# EAGLE design T-11_Version_7 (EAGLE 7.1.0)
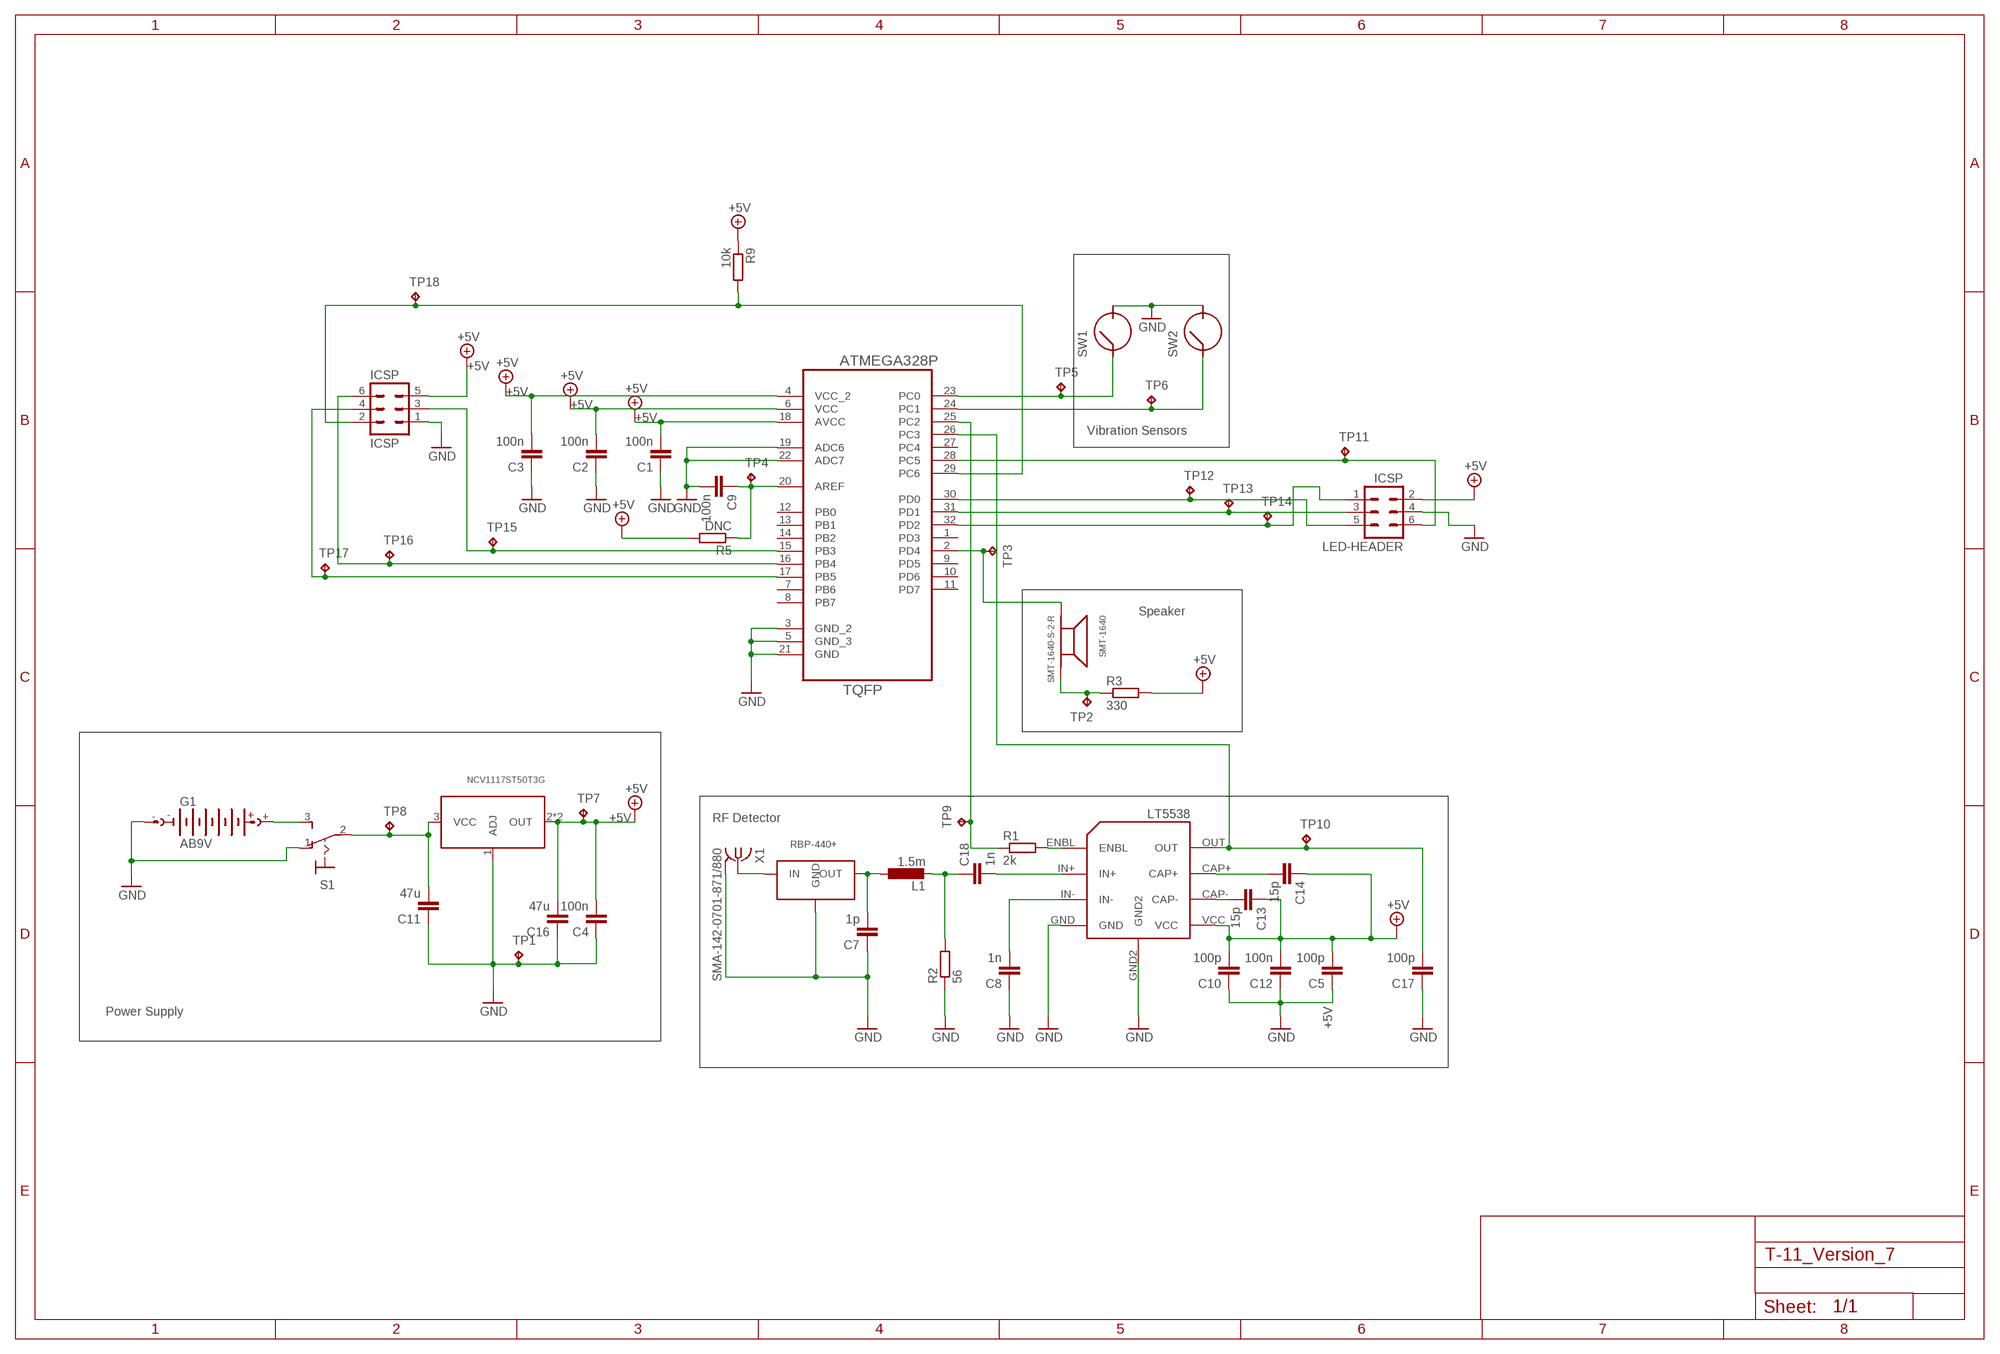
[diagram p0: schematic, sheet 1]

## Parts
C1  100n  C-EUC0805  [C0805]
C2  100n  C-EUC0805  [C0805]
C3  100n  C-EUC0805  [C0805]
C4  100n  C-EUC0805  [C0805]
C5  100p  C-EUC0805  [C0805]
C7  1p  C-EUC0805  [C0805]
C8  1n  C-EUC0805  [C0805]
C9  100n  C-EUC0805  [C0805]
C10  100p  C-EUC0805  [C0805]
C11  47u  C-EUC0805  [C0805]
C12  100n  C-EUC0805  [C0805]
C13  15p  C-EUC0805  [C0805]
C14  15p  C-EUC0805  [C0805]
C16  47u  C-EUC0805  [C0805]
C17  100p  C-EUC0805  [C0805]
C18  1n  C-EUC0805  [C0805]
G1  AB9V  [AB9V]
ICSP  ICSP  MA03-2  [MA03-2]
L1  1.5m  L-EUL2825P  [L2825P]
LED-HEADER  ICSP  MA03-2  [MA03-2]
LT5538  LT5538  [LT5538]
NVC1  NCV1117ST50T3G  [SOT223]
R1  2k  R-EU_R0805  [R0805]
R2  56  R-EU_R0805  [R0805]
R3  330  R-EU_R0805  [R0805]
R5  DNC  R-EU_R0805  [R0805]
R9  10k  R-EU_R0805  [R0805]
RBP-440+  RBP-440+  [GP731]
S1  320-916  [320-916]
SMT-1640  SMT-1640-S-2-R  [SMT-1640]
SW1  SW-1801X  [SW-1801X]
SW2  SW-1801X  [SW-1801X]
TP1  TPTP10R  [TP10R]
TP2  TPTP10R  [TP10R]
TP3  TPTP10R  [TP10R]
TP4  TPTP10R  [TP10R]
TP5  TPTP10R  [TP10R]
TP6  TPTP10R  [TP10R]
TP7  TPTP10R  [TP10R]
TP8  TPTP10R  [TP10R]
TP9  TPTP10R  [TP10R]
TP10  TPTP10R  [TP10R]
TP11  TPTP10R  [TP10R]
TP12  TPTP10R  [TP10R]
TP13  TPTP10R  [TP10R]
TP14  TPTP10R  [TP10R]
TP15  TPTP10R  [TP10R]
TP16  TPTP10R  [TP10R]
TP17  TPTP10R  [TP10R]
TP18  TPTP10R  [TP10R]
U1  ATMEGA328P-AU  [QFP80P900X900X120-32N]
X1  SMA-142-0701-871/880  [SMA-142-0701-871]

## Nets
+5V: C1.2 C2.2 C3.2 C4.2 C5.2 C10.2 C12.2 C13.1 C14.1 C16.2 ICSP.5 LED-HEADER.2 LT5538.VCC NVC1.2(OUT) NVC1.4(OUT) R3.2 R5.2 R9.1 TP7.TP U1.4(VCC_2) U1.6(VCC) U1.18(AVCC)
ANT_IN_1: C7.2 L1.1 RBP-440+.6(OUT)
ANT_IN_2: C18.1 L1.2 R2.2
GND: C1.1 C2.1 C3.1 C4.1 C5.1 C7.1 C8.1 C9.2 C10.1 C11.1 C12.1 C16.1 C17.1 G1.- ICSP.1 LED-HEADER.4 LT5538.GND LT5538.GND2 NVC1.1(ADJ) R2.1 RBP-440+.1(GND) RBP-440+.3(GND) RBP-440+.4(GND) RBP-440+.5(GND) RBP-440+.7(GND) RBP-440+.8(GND) S1.1(O) SW1.P$2 SW2.P$2 TP1.TP U1.3(GND_2) U1.5(GND_3) U1.19(ADC6) U1.21(GND) U1.22(ADC7) X1.2@1 X1.2@2 X1.2@3 X1.2@4
INDICATOR_1: LED-HEADER.1 TP14.TP U1.32(PD2)
INDICATOR_2: LED-HEADER.3 TP13.TP U1.31(PD1)
INDICATOR_3: LED-HEADER.5 TP12.TP U1.30(PD0)
MISO: ICSP.6 TP16.TP U1.16(PB4)
MOSI: ICSP.3 TP15.TP U1.15(PB3)
N$1: LED-HEADER.6 TP11.TP U1.28(PC5)
N$2: RBP-440+.2(IN) X1.1
N$3: R3.1 SMT-1640.P$1(OUT) TP2.TP
N$4: G1.+ S1.3(S)
N$5: C18.2 LT5538.IN+
N$6: LT5538.ENBL R1.2
N$8: C14.2 LT5538.CAP+
N$9: C13.2 LT5538.CAP-
N$10: C9.1 R5.1 TP4.TP U1.20(AREF)
N$12: SMT-1640.P$2(IN) TP3.TP U1.2(PD4)
PS_VIN: C11.2 NVC1.3(VCC) S1.2(P) TP8.TP
RESET: ICSP.2 R9.2 TP18.TP U1.29(PC6)
RF_ENABLE: R1.1 TP9.TP U1.25(PC2)
RF_IN-: C8.2 LT5538.IN-
RF_OUT: C17.2 LT5538.OUT TP10.TP U1.26(PC3)
SCK: ICSP.4 TP17.TP U1.17(PB5)
VIB_1: SW2.P$1 TP6.TP U1.24(PC1)
VIB_2: SW1.P$1 TP5.TP U1.23(PC0)
Unconnected: U1.1(PD3) U1.7(PB6) U1.8(PB7) U1.9(PD5) U1.10(PD6) U1.11(PD7) U1.12(PB0) U1.13(PB1) U1.14(PB2) U1.27(PC4)

## Notes on the sheet
- Vibration Sensors
- Speaker
- RF Detector
- Power Supply

## Library data of the parts
C1-C5 C7-C14 C16-C18 = rcl:C-EU: CAPACITOR, European symbol
G1 = battery:AB9V: 9-V BATTERY CLIP
ICSP LED-HEADER = con-lstb:MA03-2: PIN HEADER; OC_FARNELL: unknown; OC_NEWARK: unknown
L1 = resistor:L-EU: INDUCTOR, European symbol
LT5538 = LT5538:LT5538
NVC1 = sym:NCV1117ST50T3G
R1-R3 R5 R9 = resistor:R-EU_: RESISTOR, European symbol; SPICEPREFIX: R
RBP-440+ = RBP:RBP-440+: Band Pass Filter 410 - 470 MHZ
S1 = switch:320-916: TOGGLE SWITCH distributor RS Components
SMT-1640 = SMT:SMT-1640-S-2-R: pizo buzzer
SW1 SW2 = SW18xxx:SW-1801X: Vibration Sensor
TP1-TP18 = testpad:TP: Test pad
U1 = Ava:ATMEGA328P-AU; DESCRIPTION: 8-bit Microcontroller with In-System Programmable Flash; MPN: ATMEGA328P-AU; OC_FARNELL: 1715486; OC_NEWARK: 14R4631; PACKAGE: TQFP-32; SUPPLIER: Atmel
X1 = con-coax:SMA-: SMA 50 Ohm End Launch Jack Receptacle - Round Contact Johnson Components Source: www.johnsoncomponents.com .. J502-ND.pdf; MF: JOHNSON COMPONENTS; MPN: 142-0701-871; OC_FARNELL: 1339835; OC_NEWARK: 91B6105

## Board
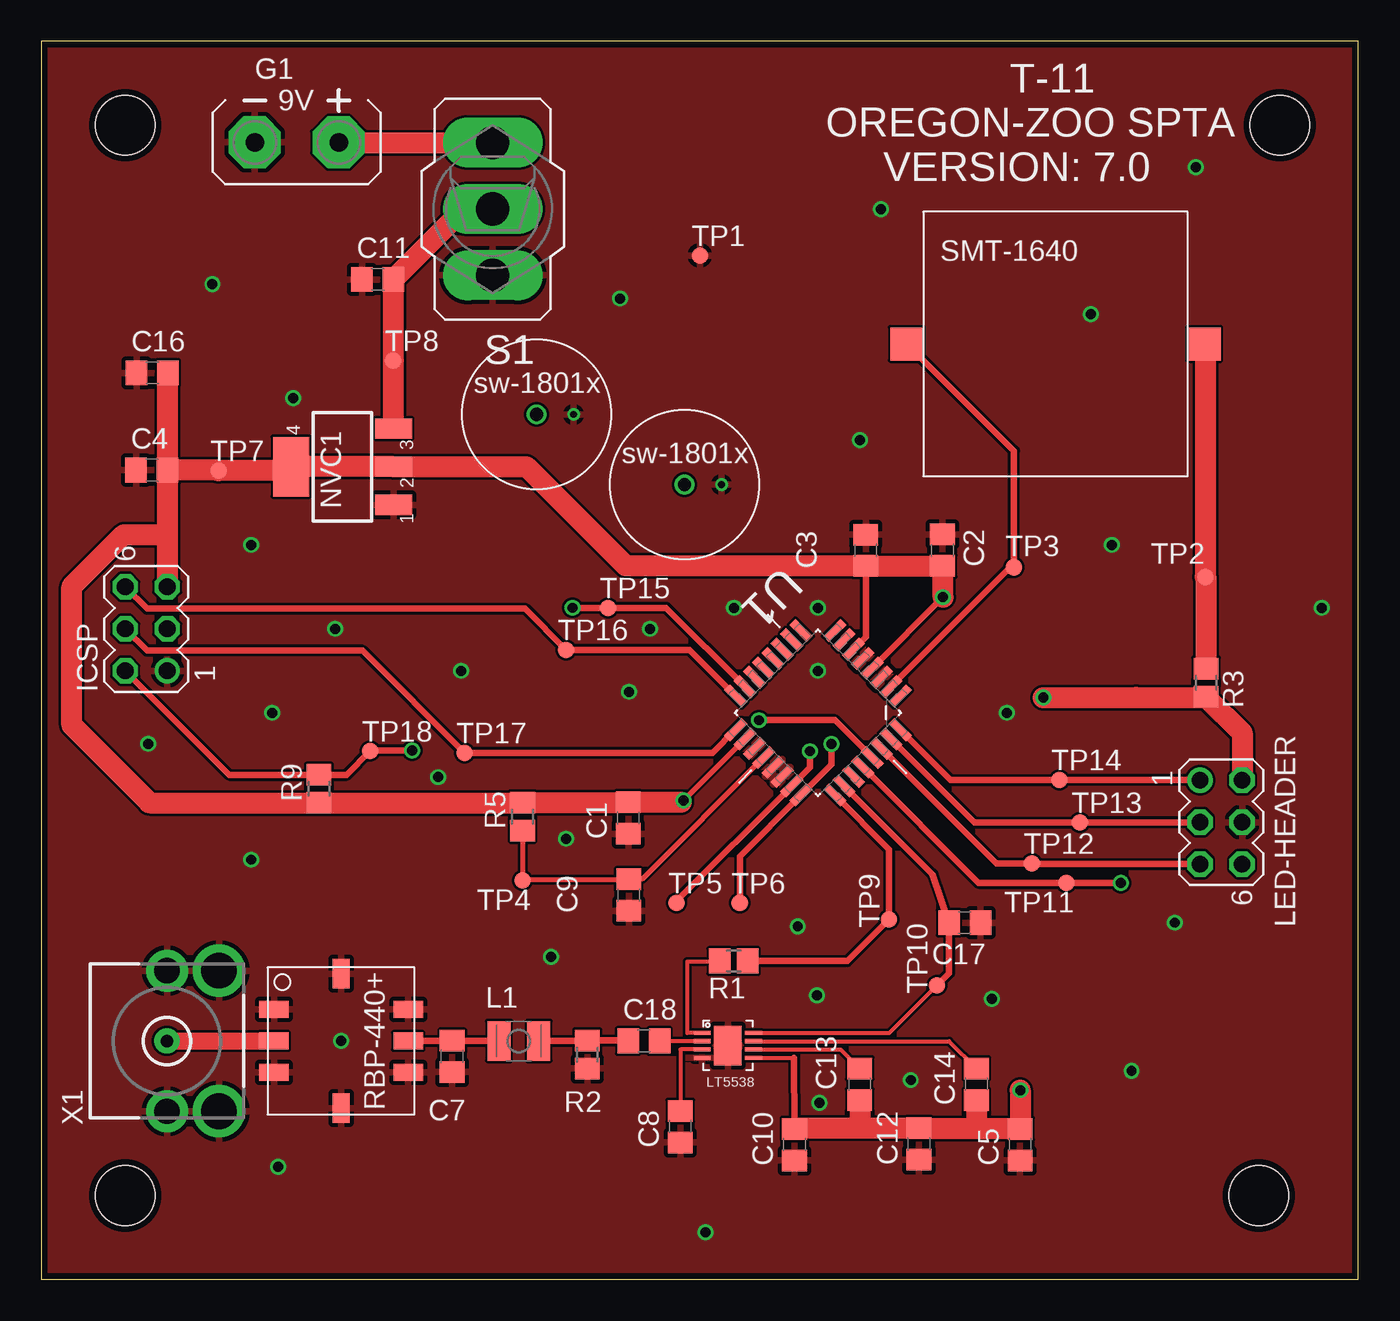
[diagram p1: board, top side]
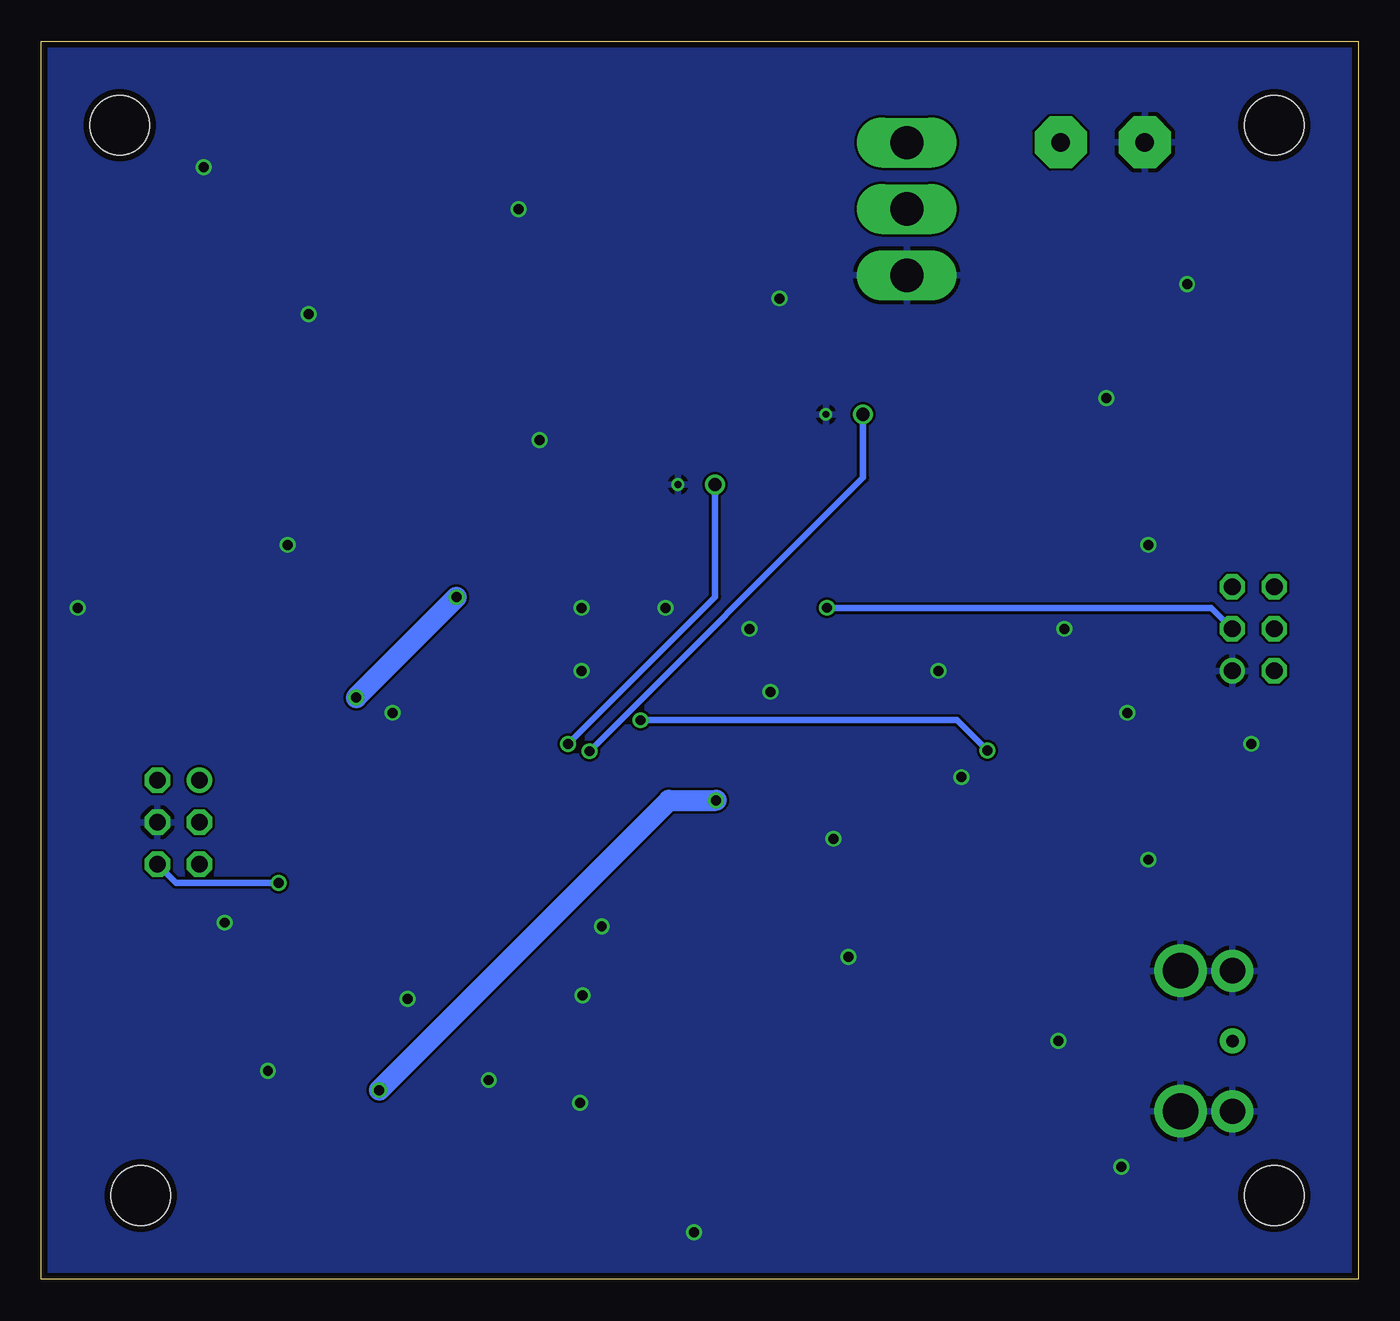
[diagram p2: board, bottom side, seen from below]

Size 79.68 x 74.92 mm. Coordinates in mm from the lower left corner, seen from the top.
Outline: 0,0 79.68,0 79.68,74.92 0,74.92 0,0
Copper layers (1*16): Top 0.0356mm / dielectric 1.5011mm / Bottom 0.0356mm
Design rules "OHS-Park": minimum track width 6mil, minimum drill 13mil, track to track 6mil, track to pad 6mil, pad to pad 6mil, via to via 6mil, smd to smd 6mil, copper to edge 15mil, drill to drill 6mil, minimum pad ring 7mil, minimum via ring 7mil, stop-mask expansion 3mil, vias tented up to drill 0mil, thermal gap 10mil
Holes 3.6 mm at 5.08,69.85 73.66,5.08 5.08,5.08 74.93,69.85

### Footprints (pad centres in the part's own frame; a part is rotated, then mirrored left to right if it is on the bottom)
C0805 = smd 1.3 x 1.5: 1 -0.95,0; 2 0.95,0
AB9V = drill 1.118 pad 3.15 octagon: + 0,2.54; - 0,-2.54
MA03-2 = drill 1.016: 1 -2.54,-1.27 | drill 1.016 octagon: 2 -2.54,1.27; 3 0,-1.27; 4 0,1.27; 5 2.54,-1.27; 6 2.54,1.27
L2825P = smd 1.4 x 2.4: 1 -1.2,0; 2 1.2,0
LT5538 = smd 0.25 x 1: CAP+ -0.22,1.58; CAP- 0.28,1.58; ENBL -0.72,-1.52; GND 0.78,-1.52; IN+ -0.22,-1.52; IN- 0.28,-1.52; OUT -0.72,1.58; VCC 0.78,1.58 | smd 2.38 x 1.65: GND2 0.05,0.025
SOT223 = smd 1.219 x 2.235: 1 -2.311,-3.099; 2 0,-3.099; 3 2.311,-3.099 | smd 3.6 x 2.2: 4 0,3.099
R0805 = smd 1.3 x 1.5: 1 -0.85,0; 2 0.85,0
GP731 = smd 1.016 x 1.778: 1 -1.905,-4.064; 2 0,-4.064; 3 1.905,-4.064; 5 1.905,4.064; 6 0,4.064; 7 -1.905,4.064 | smd 1.778 x 1.016: 4 4.064,0; 8 -4.064,0
320-916 = drill 2.007 long: 1 0,4.013; 2 0,0; 3 0,-4.013
SMT-1640 = smd 2 x 2: P$1 9,0; P$2 -9,0
SW-1801X = drill 0.8: P$1 0,0 | drill 0.406: P$2 2.25,0
TP10R = smd 1 x 1: TP 0,0
QFP80P900X900X120-32N = smd 1.473 x 0.508: 1 -4.242,2.794; 2 -4.242,2.007; 3 -4.242,1.194; 4 -4.242,0.406; 5 -4.242,-0.406; 6 -4.242,-1.194; 7 -4.242,-2.007; 8 -4.242,-2.794; 17 4.242,-2.794; 18 4.242,-2.007; 19 4.242,-1.194; 20 4.242,-0.406; 21 4.242,0.406; 22 4.242,1.194; 23 4.242,2.007; 24 4.242,2.794 | smd 0.508 x 1.473: 9 -2.794,-4.242; 10 -2.007,-4.242; 11 -1.194,-4.242; 12 -0.406,-4.242; 13 0.406,-4.242; 14 1.194,-4.242; 15 2.007,-4.242; 16 2.794,-4.242; 25 2.794,4.242; 26 2.007,4.242; 27 1.194,4.242; 28 0.406,4.242; 29 -0.406,4.242; 30 -1.194,4.242; 31 -2.007,4.242; 32 -2.794,4.242
SMA-142-0701-871 = drill 0.762 pad 1.524: 1 0,0 | drill 1.524 pad 2.54: 2@1 -4.255,0; 2@2 4.255,0 | drill 2.159 pad 2.794: 2@3 -4.255,-3.15; 2@4 4.255,-3.15

### Placement (x,y rotation side)
C1  35.52,27.92 90 top
C2  54.53,44.13 270 top
C3  49.89,44.12 270 top
C4  6.69,48.97 0 top
C5  59.22,8.16 90 top
C7  24.86,13.5 90 top
C8  38.66,9.25 90 top
C9  35.55,23.26 270 top
C10  45.57,8.15 90 top
C11  20.35,60.51 0 top
C12  53.11,8.2 90 top
C13  49.52,11.82 90 top
C14  56.57,11.82 90 top
C16  6.71,54.86 0 top
C17  55.88,21.59 180 top
C18  36.46,14.43 0 top
G1  15.45,68.81 270 top
ICSP  6.35,39.37 90 top
L1  28.89,14.43 0 top
LED-HEADER  71.39,27.67 270 top
LT5538  41.51,14.2 270 top
NVC1  18.22,49.18 90 top
R1  41.89,19.27 180 top
R2  33.04,13.62 90 top
R3  70.48,36.11 270 top
R5  29.12,28.01 90 top
R9  16.8,29.69 90 top
RBP-440+  18.14,14.43 270 top
S1  27.31,64.77 180 top
SMT-1640  61.37,56.61 0 top
SW1  29.96,52.35 0 top
SW2  38.91,48.1 0 top
TP1  39.85,61.95 0 top
TP2  70.43,42.51 180 top
TP3  58.85,43.09 0 top
TP4  29.13,24.15 180 top
TP5  38.44,22.79 0 top
TP6  42.26,22.78 0 top
TP7  10.73,48.94 0 top
TP8  21.29,55.6 0 top
TP9  51.3,21.79 90 top
TP10  54.2,17.8 90 top
TP11  62.03,24.01 180 top
TP12  59.94,25.18 0 top
TP13  62.84,27.65 0 top
TP14  61.61,30.24 0 top
TP15  34.29,40.64 0 top
TP16  31.75,38.1 0 top
TP17  25.62,31.87 0 top
TP18  19.9,31.97 0 top
U1  46.99,34.29 225 top
X1  7.61,14.43 90 top

### Tracks (layer width: path | path; a pad name or v marks a point on that pad's centre or on a via)
+5V  (via drill 0.6)
  Top 0.254: LT5538.VCC 45.55,13.42
  Top 0.305: U1.18 v38.85,28.99
  Top 0.406: 6.32,29.08 6.31,29.07 6.53,28.86 6.55,28.84 | U1.6 49.88,38.87 C3.2 49.87,43.19 | U1.4 v54.56,41.28 54.45,41.39 | 54.56,43.2 C2.2 | NVC1.4 14.75,48.94 | TP7.TP 10.7,48.97 | C4.2 7.62,48.93 | 66.21,35.21 66.23,35.23 | 45.55,13.42 C10.2 45.55,9.15 | C13.1 49.55,10.87 | 70.48,35.23 R3.2 | R5.2 | v38.85,28.99 38.73,28.87
  Top 1.27: v54.56,41.28 54.56,43.2 C2.2 C3.2 | 14.75,48.94 TP7.TP | 10.7,48.97 C4.2 | C4.2 C16.2 | v60.63,35.21 66.21,35.21 | 7.62,48.93 7.62,45.07 | 7.62,45.07 ICSP.5 | NVC1.4 NVC1.2 29.36,49.18 35.35,43.19 49.87,43.19 | 49.55,9.15 C12.2 56.53,9.15 | 49.55,9.15 45.55,9.15 | 49.55,10.87 49.55,9.15 | 66.23,35.23 70.48,35.23 | R3.2 72.66,33.08 LED-HEADER.2 | R5.2 C1.2 38.73,28.87 | 56.53,9.15 59.04,9.15 C5.2 59.24,9.13 v59.24,11.46 | C14.1 56.57,9.19 56.53,9.15 | 6.55,28.84 R9.1 29.09,28.84 R5.2 | 6.53,28.86 1.85,33.54 1.85,41.92 5,45.07 7.62,45.07
  Bottom 1.27: v54.56,41.28 v60.63,35.21 | v59.24,11.46 41.7,28.99 v38.85,28.99
ANT_IN_1
  Top 0.254: RBP-440+.6 21.99,14.43
  Top 0.406: RBP-440+.6 24.86,14.43 C7.2 28.16,14.45 28.16,14.16 27.7,14.16 L1.1
ANT_IN_2
  Top 0.406: L1.2 33.03,14.43 R2.2 35.51,14.47 C18.1
GND  (via drill 0.6)
  other vias: 10.35,60.22 31.75,26.67 50.8,64.77 69.85,67.31 64.77,44.45 63.5,58.42 77.47,40.64 35.01,59.36 24,30.4 15.24,53.34 13.97,34.29 17.78,39.37 25.4,36.83 35.56,35.56 36.83,39.37 41.91,40.64 46.99,40.64 58.42,34.29 68.58,21.59 57.51,16.97 65.97,12.62 30.84,19.51 12.7,25.4 40.19,2.85 18.14,14.43 14.33,6.81 47.09,10.68 46.92,17.19 45.77,21.37 52.61,12.07 49.53,50.8 12.7,44.45 46.99,36.83 6.46,32.42
  pour Top (isolate 0.01): 0,74.93 80.01,74.93 80.01,0 0,0
  pour Bottom (isolate 0.01): 0,74.93 80.01,74.93 80.01,0 0,0
INDICATOR_1
  Top 0.406: U1.32 55,30.24 TP14.TP 70.09,30.24 LED-HEADER.1
INDICATOR_2
  Top 0.406: U1.31 56.47,27.65 TP13.TP 70.09,27.65 LED-HEADER.3
INDICATOR_3
  Top 0.406: U1.30 57.79,25.18 TP12.TP 59.99,25.13 LED-HEADER.5
MISO
  Top 0.406: U1.16 39.23,38.1 TP16.TP 29.26,40.59 6.4,40.59 ICSP.6
MOSI  (via drill 0.6)
  Top 0.406: U1.15 37.8,40.64 TP15.TP v32.14,40.64
  Bottom 0.406: v32.14,40.64 8.89,40.64 ICSP.3
N$1  (via drill 0.6)
  Top 0.406: U1.28 56.7,24.01 TP11.TP 62.04,24 v65.32,24
  Bottom 0.406: v65.32,24 71.52,24 LED-HEADER.6
N$2
  Top 1.016: X1.1 RBP-440+.2
N$3
  Top 0.813: SMT-1640.P$1 70.43,56.55 | TP2.TP 70.48,42.47
  Top 1.27: 70.43,56.55 TP2.TP | 70.48,42.47 R3.1
N$4
  Top 1.27: G1.+ 18.01,68.79 S1.3
N$5
  Top 0.254: C18.2 39.99,14.43 LT5538.IN+
N$6
  Top 0.254: LT5538.ENBL 39.09,14.92 39.09,19.25 41.04,19.25 R1.2
N$8
  Top 0.254: LT5538.CAP+ 54.92,14.42 C14.2
N$9
  Top 0.254: LT5538.CAP- 48.36,13.92 C13.2
N$10
  Top 0.305: R5.1 TP4.TP 29.19,24.21 C9.1 36.33,24.21 U1.20
N$12
  Top 0.406: U1.2 58.63,43.09 TP3.TP 58.85,50.13 SMT-1640.P$2
PS_VIN
  Top 1.27: NVC1.3 21.29,51.52 TP8.TP 21.29,60.47 C11.2 25.56,64.78 S1.2
RESET  (via drill 0.6)
  Top 0.406: U1.29 48.01,33.84 v43.43,33.84 | v22.44,32.02 19.95,32.02 TP18.TP 18.48,30.54 R9.2 11.37,30.54 ICSP.2
  Bottom 0.406: v43.43,33.84 24.27,33.84 v22.44,32.02
RF_ENABLE
  Top 0.406: U1.25 51.3,26.03 TP9.TP 48.77,19.27 R1.1
RF_IN-
  Top 0.254: LT5538.IN- 38.66,13.92 C8.2
RF_OUT
  Top 0.254: LT5538.OUT 51.31,14.92 TP10.TP
  Top 0.406: U1.26 53.93,24.51 C17.2 54.93,18.54 TP10.TP
SCK
  Top 0.406: ICSP.4 6.39,38.05 19.43,38.05 TP17.TP 40.62,31.87 U1.17
VIB_1  (via drill 0.6)
  Top 0.406: TP6.TP 42.26,25.61 U1.24 47.81,31.16 v47.81,32.41
  Bottom 0.406: v47.81,32.41 38.91,41.31 SW2.P$1
VIB_2  (via drill 0.6)
  Top 0.406: TP5.TP 38.44,22.91 U1.23 46.51,30.97 v46.51,31.96
  Bottom 0.406: v46.51,31.96 29.96,48.51 SW1.P$1

### Text on the board
tNames: T-11 / OREGON-ZOO SPTA / VERSION: 7.0